# Altium project Proyecto0_V2.PrjPcb (part 3 of 3)

## Sheet USB_Port_FTT.SchDoc
size 431 x 279 mm; DrawnBy: Santiago Rodriguez; Revision: V1; SheetNumber: 3; SheetTotal: 9
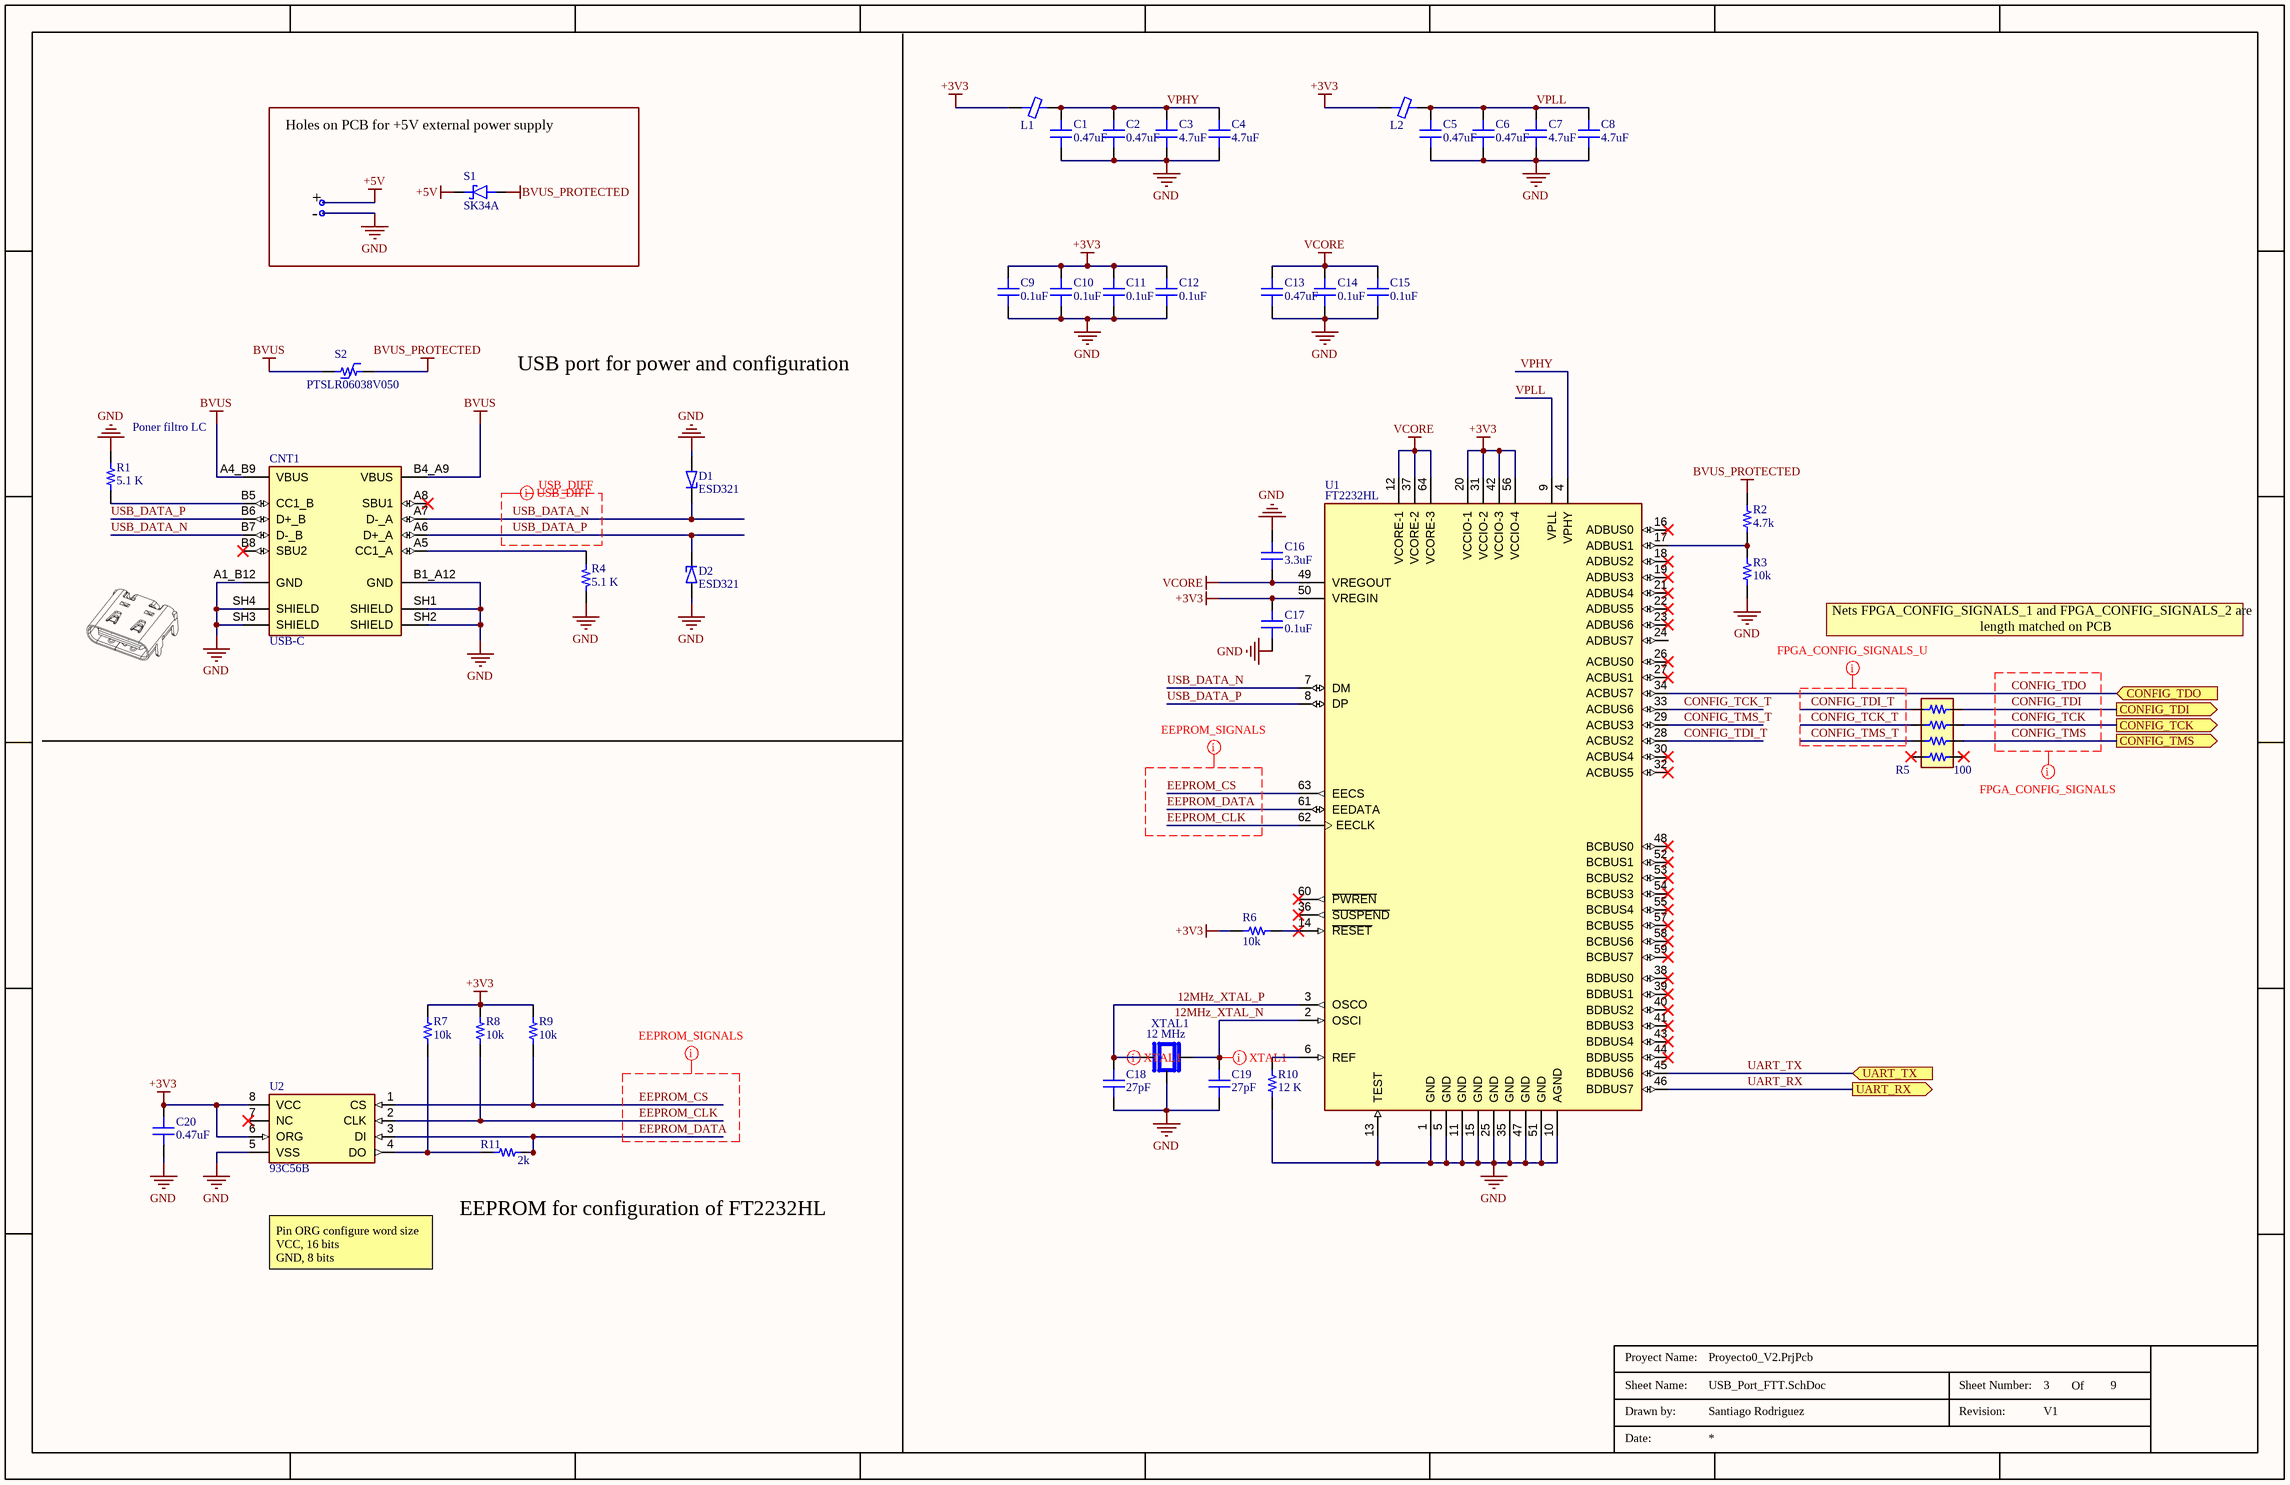
[diagram p11: USB_Port_FTT.SchDoc]

### Parts
C1  0.47uF  [CAP0402]
C2  0.47uF  [CAP0402]
C3  4.7uF  [CAP0402]
C4  4.7uF  [CAP0402]
C5  0.47uF  [CAP0402]
C6  0.47uF  [CAP0402]
C7  4.7uF  [CAP0402]
C8  4.7uF  [CAP0402]
C9  0.1uF  [CAP0402]
C10  0.1uF  [CAP0402]
C11  0.1uF  [CAP0402]
C12  0.1uF  [CAP0402]
C13  0.47uF  [CAP0402]
C14  0.1uF  [CAP0402]
C15  0.1uF  [CAP0402]
C16  3.3uF  [CAP0402]
C17  0.1uF  [CAP0402]
C18  27pF  [CAP0402]
C19  27pF  [CAP0402]
C20  0.47uF  [CAP0402]
CNT1  USB-C  [USB-C 2.0 24 PINS (16+8 DUMMY)]
D1  ESD321  [SOD-523]
D2  ESD321  [SOD-523]
L1  HZ0603C651R-10  [Fer0603]  (value not drawn)
L2  HZ0603C651R-10  [Fer0603]  (value not drawn)
R1  5.1 K  [RES0603]
R2  4.7k  [RES0402]
R3  10k  [RES0402]
R4  5.1 K  [RES0603]
R5  100  [ArrayResistor-1206]
R6  10k  [RES0402]
R7  10k  [RES0402]
R8  10k  [RES0402]
R9  10k  [RES0402]
R10  12 K  [RES0603]
R11  2k  [RES0402]
S1  SK34A  [Diode SMA-2]
S2  PTSLR06038V050  [PTSLR0603]
U1  FT2232HL  [LQPF-64]
U2  93C56B  [DFN-8]
XTAL1  12 MHz  [XTAL_ABM8G]

### Ports
CONFIG_TCK (out), CONFIG_TDI (out), CONFIG_TDO (in), CONFIG_TMS (out), UART_RX (out), UART_TX (in)

### Nets
+3V3: C9.2 C10.2 C11.2 C12.2 C17.2 C20.2 L1.1 L2.1 R6.1 R7.2 R8.2 R9.2 U1.20(VCCIO-1) U1.31(VCCIO-2) U1.42(VCCIO-3) U1.50(VREGIN) U1.56(VCCIO-4) U2.6(ORG) U2.8(VCC)
+5V: S1.C(K)
BVUS: CNT1.A4_B9(VBUS) CNT1.B4_A9(VBUS) S2.1
BVUS_PROTECTED: R2.2 S1.A S2.2
GND: C1.1 C2.1 C3.1 C4.1 C5.1 C6.1 C7.1 C8.1 C9.1 C10.1 C11.1 C12.1 C13.1 C14.1 C15.1 C16.2 C17.1 C18.1 C19.1 C20.1 CNT1.A1_B12(GND) CNT1.B1_A12(GND) CNT1.SH1(SHIELD) CNT1.SH2(SHIELD) CNT1.SH3(SHIELD) CNT1.SH4(SHIELD) D1.A D2.A R1.2 R3.1 R4.2 R10.1 U1.1(GND) U1.5(GND) U1.10(AGND) U1.11(GND) U1.13(TEST) U1.15(GND) U1.25(GND) U1.35(GND) U1.47(GND) U1.51(GND) U2.5(VSS) XTAL1.2
VCORE: C13.2 C14.2 C15.2 C16.1 U1.12(VCORE-1) U1.37(VCORE-2) U1.49(VREGOUT) U1.64(VCORE-3)
12MHz_XTAL_N: C19.2 U1.2(OSCI) XTAL1.3
12MHz_XTAL_P: C18.2 U1.3(OSCO) XTAL1.1
CONFIG_TCK: R5.7 ; port CONFIG_TCK
CONFIG_TCK_T: R5.3 U1.33(ACBUS6)
CONFIG_TDI: R5.8 ; port CONFIG_TDI
CONFIG_TDI_T: R5.1 U1.28(ACBUS2)
CONFIG_TDO: U1.34(ACBUS7) ; port CONFIG_TDO
CONFIG_TMS: R5.6 ; port CONFIG_TMS
CONFIG_TMS_T: R5.2 U1.29(ACBUS3)
EEPROM_CLK: R8.1 U1.62(EECLK) U2.2(CLK)
EEPROM_CS: R9.1 U1.63(EECS) U2.1(CS)
EEPROM_DATA: R11.2 U1.61(EEDATA) U2.3(DI)
UART_RX: U1.46(BDBUS7) ; port UART_RX
UART_TX: U1.45(BDBUS6) ; port UART_TX
USB_DATA_N: CNT1.A7(D-_A) CNT1.B7(D-_B) D1.K U1.7(DM)
USB_DATA_P: CNT1.A6(D+_A) CNT1.B6(D+_B) D2.K U1.8(DP)
VPHY: C1.2 C2.2 C3.2 C4.2 L1.2 U1.4(VPHY)
VPLL: C5.2 C6.2 C7.2 C8.2 L2.2 U1.9(VPLL)
NetCNT1_A5: CNT1.A5(CC1_A) R4.1
NetCNT1_B5: CNT1.B5(CC1_B) R1.1
NetR2_1: R2.1 R3.2 U1.17(ADBUS1)
NetR6_2: R6.2 U1.14(~{RESET})
NetR7_1: R7.1 R11.1 U2.4(DO)
NetR10_2: R10.2 U1.6(REF)

Not connected (* = marked no-connect by the designer): CNT1 A8(SBU1)* B8(SBU2)*; R5 4* 5*; U1 16(ADBUS0)* 18(ADBUS2)* 19(ADBUS3)* 21(ADBUS4)* 22(ADBUS5)* 23(ADBUS6)* 24(ADBUS7) 26(ACBUS0)* 27(ACBUS1)* 30(ACBUS4)* 32(ACBUS5)* 36(~{SUSPEND})* 38(BDBUS0)* 39(BDBUS1)* 40(BDBUS2)* 41(BDBUS3)* 43(BDBUS4)* 44(BDBUS5)* 48(BCBUS0)* 52(BCBUS1)* 53(BCBUS2)* 54(BCBUS3)* 55(BCBUS4)* 57(BCBUS5)* 58(BCBUS6)* 59(BCBUS7)* 60(~{PWREN})*; U2 7(NC)*

### Layout directives
differential pair: 12MHz_XTAL_N, 12MHz_XTAL_P
differential pair; differential pair class USB_DIFF: USB_DATA_N, USB_DATA_P
net class EEPROM_SIGNALS: EEPROM_CLK, EEPROM_CS, EEPROM_DATA
net class FPGA_CONFIG_SIGNALS: CONFIG_TCK, CONFIG_TDI, CONFIG_TDO, CONFIG_TMS
net class FPGA_CONFIG_SIGNALS_U: CONFIG_TCK_T, CONFIG_TDI_T, CONFIG_TMS_T

### Notes on the sheet
- Holes on PCB for +5V external power supply
- +
- -
- (near R1) Poner filtro LC
- USB port for power and configuration <MF-NSMF050>
- Nets FPGA_CONFIG_SIGNALS_1 and FPGA_CONFIG_SIGNALS_2 are
- length matched on PCB
- (near R11) EEPROM for configuration of FT2232HL <MF-NSMF050>
- Pin ORG configure word size
  VCC, 16 bits
  GND, 8 bits
- Proyect Name:
- Sheet Name:
- Drawn by:
- Revision:
- Sheet Number:
- Of
- Date:

### Library data of the parts
C1 C2 C5 C6 C13 C20 = C0402C474K8RAC: CAP CER 0.47uF 10V X7R 0402 10%; PartNumber: C0603C474K4RAC; Manufacturer: Kemet; ComponentLink1Description: DataSheet; ComponentLink1URL: https://content.kemet.com/datasheets/KEM_C1002_X7R_SMD.pdf; Size: 0402; ComponentLink2Description: DigiKey; ComponentLink2URL: https://www.digikey.com/en/products/filter/ceramic-capacitors/60?s=N4IgTCBcDaIMIAYAsCxyQdiQaQBwCUBBOEAXQF8g; ComponentLink3Description: ProductPage; ComponentLink3URL: https://www.kemet.com/en/us/product/C0805C474K4RACTU.html; Tolerance: 10%; Value: 0.47uF; Voltage: 10 V
C3 C4 C7 C8 = C0402C475M9PAC: CAP CER 4.7uF 6.3V X5R 0402 10%; Manufacturer: Kemet; Voltage: 16V; ComponentLink1Description: DataSheet; ComponentLink1URL: https://content.kemet.com/datasheets/KEM_C1002_X7R_SMD.pdf; Size: 0402; ComponentLink2Description: DigiKey; ComponentLink2URL: https://www.digikey.com/en/products/filter/ceramic-capacitors/60?s=N4IgTCBcDaIMIAYAsCxyQdgKwFsCcADgIYDGIAugL5A; PartNumber: C0402C475M9PAC; ComponentLink3Description: ProdructPage; ComponentLink3URL: https://www.kemet.com/en/us/search.html?q=C0402C475M9PAC; Value: 4.7uF; Tolerance: 10%
C9-C12 C14 C15 C17 = C0402C104K4RAC: CAP CER 0.1uF 16V X7R 0402 10%; Manufactuer: Kemet; ComponentLink1Description: DataSheet; ComponentLink1URL: https://content.kemet.com/datasheets/KEM_C1002_X7R_SMD.pdf; ComponentLink2Description: DigiKey; ComponentLink2URL: https://www.digikey.com/en/products/filter/ceramic-capacitors/60?s=N4IgTCBcDaIMIAYAsCxwIzINJIEoEE4QBdAXyA; Value: 0.1uF; Tolerance: 10%; Size: 0402; Voltage: 16V; PartNumber: C0402C104K4RAC
C16 = C0402C332K5RAC: CAP CER 3.3nF 50V X7R 0402 10%; Manufacturer: Kemet; ComponentLink1Description: DataSheet; ComponentLink1URL: https://content.kemet.com/datasheets/KEM_C1002_X7R_SMD.pdf; Size: 0402; ComponentLink2Description: DigiKey; ComponentLink2URL: https://www.digikey.com/en/products/filter/ceramic-capacitors/60?s=N4IgTCBcDaIMIAYAsCxwMzrAaQKwCUBBOEAXQF8g; Value: 3.3uF; PartNumber: C0402C332K5RAC; Tolerance: 10%; Voltage: 50V
C18 C19 = C0402C270K5RAC: CAP CER 27pF 50V X7R 0402 10%; Manufacturer: Kemet; ComponentLink1Description: DataSheet; ComponentLink1URL: https://content.kemet.com/datasheets/KEM_C1002_X7R_SMD.pdf; Size: 0402; ComponentLink2Description: DigiKey; ComponentLink2URL: https://www.digikey.com/en/products/detail/kemet/C0402C270K5RACTU/18167653?s=N4IgTCBcDaIMIAYAsCxzAdgQaQKwCUBBOEAXQF8g; Value: 27pF; Tolerance: 10%; PartNumber: C0402C270K5RAC; Voltage: 50V
CNT1 = USB-C: CONN USB2.0, TYP C, 24 PINS (16+8 DUMMY), SMD, RIGHT ANGLE; ComponentLink1Description: DigiKey; ComponentLink1URL: https://www.digikey.com/en/products/detail/amphenol-cs-commercial-products/12402012E212A/13683192; ComponentLink2Description: DataSheet; ComponentLink2URL: https://mm.digikey.com/Volume0/opasdata/d220001/medias/docus/2614/C12402012-4.pdf; Type: C 2.0; Pins: 24 (16+8 DUMMY)
D1 D2 = ESD321: 0.9pF 3.6V ±30kV ESD protection diode with 6.8V 16A TLP clamping for USB 2.0; Manufacturer: Texas Instruments; ComponentLink1Description: ProductPage; ComponentLink1URL: https://www.ti.com/product/ESD321; Package: SOD-523; ComponentLink2Description: DataSheet; ComponentLink2URL: https://www.ti.com/lit/ds/symlink/esd321.pdf?ts=1717079562669&ref_url=https%253A%252F%252Fwww.ti.com%252Fproduct%252FESD321%253FkeyMatch%253DESD321%2526tisearch%253Dsearch-everything%2526usecase%253DGPN-ALT; ComponentLink3Description: DigyKey; ComponentLink3URL: https://www.digikey.com/en/products/detail/texas-instruments/ESD321DYAR/17394968; PartNumber: ESD321
L1 L2 = HZ0603C651R-10: FERRITE BEAD 650 OHM 0603 1LN 0603; Z@100MHz: 650 Ohms; Current: 300 mA; DCR: 0.6 Ohm; ComponentLink1Description: DataSheet; ComponentLink1URL: https://www.laird.com/sites/default/files/hz0603c651r-10-datasheet.pdf; ComponentLink2Description: DigiKey; ComponentLink2URL: https://www.digikey.com/es/products/detail/laird-signal-integrity-products/HZ0603C651R-10/806620?s=N4IgTCBcDaIBIC0AMA2JBmAwigrARgCUBaPJEAXQF8g; PartNumber: HZ0603C651R-10; Size: 0603
R1 R4 = CRCW06035K10FKEA: RES SMD 5.1K OHM 1% 1/10W 0603; Value: 47 K; ComponentLink1Description: DataSheet; ComponentLink1URL: https://www.vishay.com/docs/20035/dcrcwe3.pdf; Size: 0603; ComponentLink2Description: DigiKey; ComponentLink2URL: https://www.digikey.com/es/products/detail/vishay-dale/crcw06035k10fkea/1174748
R2 = CRCW04024K70FK: RES SMD 4.7K OHM 1% 0.063W 0402; Manufacturer: Vishay; ComponentLink1Description: DataSheet; ComponentLink1URL: https://www.vishay.com/docs/20035/dcrcwe3.pdf; Size: 0402; ComponentLink2Description: DigiKey; ComponentLink2URL: https://www.digikey.com/es/products/filter/resistor-de-chip-montaje-en-superficie/52?s=N4IgTCBcDaIMICU4HUAMAWVZ0GkDsqAYjiALoC%20QA; Power: 0.063 W; PartNumber: CRCW04024K70FK; Value: 4.7k; Tolerance: 1%
R3 R6-R9 = CRCW040210K0FK: RES SMD 10K OHM 1% 0.063W 0402; Manufacturer: Vishay; ComponentLink1Description: DataSheet; ComponentLink1URL: https://www.vishay.com/docs/20035/dcrcwe3.pdf; Size: 0402; ComponentLink2Description: DigiKey; ComponentLink2URL: https://www.digikey.com/en/products/filter/chip-resistor-surface-mount/52?s=N4IgTCBcDaIMICU4HUAMAWVYCMqDSqAYniALoC%20QA; Value: 10k; Tolerance: 1%; PartNumber: CRCW040210K0FK; Power: 0.063W
R5 = EXB-38V101JV: RES ARRAY 4 RES 100 OHM 1206; Elements: 4; Value: 100 Ohms; ComponentLink1Description: DigiKey; ComponentLink1URL: https://www.digikey.com/en/products/detail/panasonic-electronic-components/EXB-38V101JV/256519?s=N4IgTCBcDaIKIA0BCBaAzADgGoEYAMOAUliALoC%2BQA; ComponentLink2Description: DataSheet; ComponentLink2URL: https://industrial.panasonic.com/cdbs/www-data/pdf/AOC0000/AOC0000C14.pdf; Size: 1206
R10 = CRCW060312K0FKEA: RES SMD 12K OHM 1% 1/10W 0603; ComponentLink1Description: DataSheet; ComponentLink1URL: https://www.vishay.com/docs/20035/dcrcwe3.pdf; Size: 0603; ComponentLink2Description: DigiKey; ComponentLink2URL: https://www.digikey.com/en/products/detail/vishay-dale/CRCW060312K0FKEA/1174790
R11 = CRCW04022K00FK: RES SMD 2K OHM 1% 0.063W 0402; Manufacturer: Vishay; ComponentLink1Description: DataSheet; ComponentLink1URL: https://www.vishay.com/docs/20035/dcrcwe3.pdf; ComponentLink2Description: DigiKey; ComponentLink2URL: https://www.digikey.com/en/products/filter/chip-resistor-surface-mount/52?s=N4IgTCBcDaIMYCc4HcAMAWVYwGtWoDMcQBdAXyA; PartNumber: CRCW04022K00FK; Power: 0.063W; Value: 2k; Tolerance: 1%; Size: 0402
S1 = SK34A: Diode schottky 40V 3A; Manufacturer: SMC Diode Solutions; Forward Voltage Drop: 0.63; ComponentLink1Description: DigiKey; ComponentLink1URL: https://www.digikey.com/en/products/detail/smc-diode-solutions/SK34A/6022681; Peak Reverse Voltage: 40V; Forward Current: 3A; ComponentLink2Description: DataSheet; ComponentLink2URL: https://www.smc-diodes.com/propdf/SK34A%20N0103%20REV.C.pdf; Package: SMA-2; PartNumber: SK34A
S2 = PTSLR06038V050: PTC resettable fuse 500mA, 8V, 0603; Manufacturer: Eaton; Itrip: 1A; MaxCurrent: 25A; ComponentLink1Description: DataSheet; ComponentLink1URL: https://www.eaton.com/content/dam/eaton/products/electronic-components/resources/data-sheet/eaton-ptslr0603-surface-mount-resettable-fuse-data-sheet-elx1047-en.pdf; PartNumber: PTSLR06038V050; Size: 0603; Ihold: 500mA; ComponentLink2Description: DigiKey; ComponentLink2URL: https://www.digikey.com/es/products/detail/eaton-electronics-division/PTSLR06038V050/15193495?s=N4IgTCBcDaIAoBUDKAZASgBgGwYMwA4A1DAVgxAF0BfIA; MaxVoltage: 8V
U1 = FT2232HL: Dual High Speed USB to Multipurpose UART/FIFO IC; Manufacturer: FTDI Chip; ComponentLink1Description: DataSheet; ComponentLink1URL: https://ftdichip.com/wp-content/uploads/2020/07/DS_FT2232H.pdf; ComponentLink2Description: DigiKey; ComponentLink2URL: https://www.digikey.com/en/products/detail/ftdi-future-technology-devices-international-ltd/FT2232HL-REEL/1986053; Package: LQFP-64; PartNumber: FT2232HL
U2 = EEPROM: 2K Microwire Compatible Serial EEPROM; ComponentLink1Description: DataSheet; ComponentLink1URL: https://www.snapeda.com/parts/93C56BT-I/MC/Microchip/datasheet/
XTAL1 = XTAL_12MHz: Crystal 12 MHz; Manufacturer: Abracom; ComponentLink1Description: DataDheet; ComponentLink1URL: https://www.snapeda.com/parts/ABM8G-16.000MHZ-B4Y-T/Abracon/datasheet/; Frequency: 12 MHz; Series: ABM8G

## Nets that join several sheets
+1V: FPGA_Power&Ports (17 pins), Power_Supply (5 pins)
+1V8: Bank_A-B-C-D (CNT4.33 CNT4.36 CNT4.37), FPGA_Power&Ports (10 pins), Power_Supply (7 pins)
+1V8': FPGA_Power&Ports (C36.2 L3.1), Power_Supply (C98.2 R44.2 U7.7)
+1V25_VREF_ADC: Bank_A-B-C-D (CNT4.40), FPGA_Power&Ports (C52.2 C53.2 U4.J8 U5.2)
+1V35: DDR_Memory (28 pins), FPGA_Power&Ports (13 pins), Power_Supply (C97.2 L8.2 R25.2 R41.2)
+3V3: Bank_A-B-C-D (32 pins), Flash_Memory (5 pins), FPGA_Power&Ports (34 pins), Leds_and_Buttons (R48.2), Power_Supply (7 pins), USB_Port_FTT (19 pins)
+3V3/+1V8: FPGA_Power&Ports (8 pins), Power_Supply (U9.B1)
+5V: Bank_A-B-C-D (8 pins), Power_Supply (11 pins), USB_Port_FTT (S1.C)
AGND: Bank_A-B-C-D (CNT4.39), FPGA_Power&Ports (8 pins)
GND: Bank_A-B-C-D (32 pins), DDR_Memory (34 pins), Flash_Memory (C21.1 U3.4 U3.9), FPGA_Power&Ports (80 pins), Leds_and_Buttons (10 pins), Power_Supply (41 pins), USB_Port_FTT (44 pins)
100MHz: Bank_A-B-C-D (CNT4.43), FPGA_Power&Ports (U4.N11 XTAL2.3)
A2: Bank_A-B-C-D (CNT5.39), FPGA_Power&Ports (U4.A3)
A3: Bank_A-B-C-D (CNT5.45), FPGA_Power&Ports (U4.B7)
A4: Bank_A-B-C-D (CNT5.6), FPGA_Power&Ports (U4.C6)
A5: Bank_A-B-C-D (CNT5.5), FPGA_Power&Ports (U4.C7)
A7: Bank_A-B-C-D (CNT5.3), FPGA_Power&Ports (U4.D6)
ADD0: DDR_Memory (U6.N3), FPGA_Power&Ports (U4.D8)
ADD1: DDR_Memory (U6.P7), FPGA_Power&Ports (U4.E13)
ADD2: DDR_Memory (U6.P3), FPGA_Power&Ports (U4.E12)
ADD3: DDR_Memory (U6.N2), FPGA_Power&Ports (U4.F14)
ADD4: DDR_Memory (U6.P8), FPGA_Power&Ports (U4.F12)
ADD5: DDR_Memory (U6.P2), FPGA_Power&Ports (U4.G14)
ADD6: DDR_Memory (U6.R8), FPGA_Power&Ports (U4.H12)
ADD7: DDR_Memory (U6.R2), FPGA_Power&Ports (U4.E11)
ADD8: DDR_Memory (U6.T8), FPGA_Power&Ports (U4.D13)
ADD9: DDR_Memory (U6.R3), FPGA_Power&Ports (U4.H14)
ADD10: DDR_Memory (U6.L7), FPGA_Power&Ports (U4.B11)
ADD11: DDR_Memory (U6.R7), FPGA_Power&Ports (U4.F13)
ADD12: DDR_Memory (U6.N7), FPGA_Power&Ports (U4.D11)
ADD13: DDR_Memory (U6.T3), FPGA_Power&Ports (U4.G11)
ADD14: DDR_Memory (U6.T7), FPGA_Power&Ports (U4.H13)
B1: Bank_A-B-C-D (CNT5.15), FPGA_Power&Ports (U4.D3)
B2: Bank_A-B-C-D (CNT5.40), FPGA_Power&Ports (U4.A4)
B4: Bank_A-B-C-D (CNT5.46), FPGA_Power&Ports (U4.D5)
B5: Bank_A-B-C-D (CNT5.48), FPGA_Power&Ports (U4.F4)
B6: Bank_A-B-C-D (CNT5.49), FPGA_Power&Ports (U4.F5)
B7: Bank_A-B-C-D (CNT5.2), FPGA_Power&Ports (U4.D4)
BA0: DDR_Memory (U6.M2), FPGA_Power&Ports (U4.C8)
BA1: DDR_Memory (U6.N8), FPGA_Power&Ports (U4.C12)
BA2: DDR_Memory (U6.M3), FPGA_Power&Ports (U4.D9)
C1: Bank_A-B-C-D (CNT5.14), FPGA_Power&Ports (U4.B4)
C2: Bank_A-B-C-D (CNT5.12), FPGA_Power&Ports (U4.C4)
C3: Bank_A-B-C-D (CNT5.11), FPGA_Power&Ports (U4.B5)
C4: Bank_A-B-C-D (CNT5.33), FPGA_Power&Ports (U4.E1)
C6: Bank_A-B-C-D (CNT5.9), FPGA_Power&Ports (U4.E5)
C7: Bank_A-B-C-D (CNT5.8), FPGA_Power&Ports (U4.B6)
~{CAS}: DDR_Memory (U6.K3), FPGA_Power&Ports (U4.C11)
~{CS}: DDR_Memory (U6.L2), FPGA_Power&Ports (U4.J16)
CK_N: DDR_Memory (U6.K7), FPGA_Power&Ports (U4.H16)
CK_P: DDR_Memory (U6.J7), FPGA_Power&Ports (U4.G16)
CKE: DDR_Memory (U6.K9), FPGA_Power&Ports (U4.G12)
CONFIG_TCK: Bank_A-B-C-D (CNT4.30), FPGA_Power&Ports (U4.L7), USB_Port_FTT (R5.7)
CONFIG_TDI: Bank_A-B-C-D (CNT4.28), FPGA_Power&Ports (U4.N7), USB_Port_FTT (R5.8)
CONFIG_TDO: Bank_A-B-C-D (CNT4.34), FPGA_Power&Ports (U4.N8), USB_Port_FTT (U1.34)
CONFIG_TMS: Bank_A-B-C-D (CNT4.31), FPGA_Power&Ports (U4.M7), USB_Port_FTT (R5.6)
D1: Bank_A-B-C-D (CNT5.36), FPGA_Power&Ports (U4.B1)
D3: Bank_A-B-C-D (CNT5.18), FPGA_Power&Ports (U4.A2)
D4: Bank_A-B-C-D (CNT5.34), FPGA_Power&Ports (U4.E2)
D5: Bank_A-B-C-D (CNT5.42), FPGA_Power&Ports (U4.A5)
D6: Bank_A-B-C-D (CNT5.43), FPGA_Power&Ports (U4.A7)
~{DDR_RESET}: DDR_Memory (U6.T2), FPGA_Power&Ports (U4.J15)
DONE: Bank_A-B-C-D (CNT4.12), FPGA_Power&Ports (R16.1 R17.1 U4.H10)
DQ0: DDR_Memory (U6.E3), FPGA_Power&Ports (U4.C14)
DQ1: DDR_Memory (U6.F7), FPGA_Power&Ports (U4.B12)
DQ2: DDR_Memory (U6.F2), FPGA_Power&Ports (U4.D15)
DQ3: DDR_Memory (U6.F8), FPGA_Power&Ports (U4.A15)
DQ4: DDR_Memory (U6.H3), FPGA_Power&Ports (U4.E15)
DQ5: DDR_Memory (U6.H8), FPGA_Power&Ports (U4.C13)
DQ6: DDR_Memory (U6.G2), FPGA_Power&Ports (U4.D14)
DQ7: DDR_Memory (U6.H7), FPGA_Power&Ports (U4.F15)
DQ8: DDR_Memory (U6.D7), FPGA_Power&Ports (U4.A10)
DQ9: DDR_Memory (U6.C3), FPGA_Power&Ports (U4.A14)
DQ10: DDR_Memory (U6.C8), FPGA_Power&Ports (U4.B9)
DQ11: DDR_Memory (U6.C2), FPGA_Power&Ports (U4.A13)
DQ12: DDR_Memory (U6.A7), FPGA_Power&Ports (U4.A8)
DQ13: DDR_Memory (U6.A2), FPGA_Power&Ports (U4.A12)
DQ14: DDR_Memory (U6.B8), FPGA_Power&Ports (U4.A9)
DQ15: DDR_Memory (U6.A3), FPGA_Power&Ports (U4.B10)
E1: Bank_A-B-C-D (CNT5.24), FPGA_Power&Ports (U4.D1)
E2: Bank_A-B-C-D (CNT5.37), FPGA_Power&Ports (U4.B2)
E3: Bank_A-B-C-D (CNT5.17), FPGA_Power&Ports (U4.C3)
E5: Bank_A-B-C-D (CNT5.21), FPGA_Power&Ports (U4.C2)
E6: Bank_A-B-C-D (CNT4.14), FPGA_Power&Ports (U4.H5)
F2: Bank_A-B-C-D (CNT5.23), FPGA_Power&Ports (U4.C1)
F3: Bank_A-B-C-D (CNT5.30), FPGA_Power&Ports (U4.F2)
F4: Bank_A-B-C-D (CNT5.31), FPGA_Power&Ports (U4.F3)
F5: Bank_A-B-C-D (CNT5.20), FPGA_Power&Ports (U4.E3)
G1: Bank_A-B-C-D (CNT3.15), FPGA_Power&Ports (U4.H3)
G2: Bank_A-B-C-D (CNT3.14), FPGA_Power&Ports (U4.H2)
G4: Bank_A-B-C-D (CNT5.27), FPGA_Power&Ports (U4.G1)
G5: Bank_A-B-C-D (CNT5.28), FPGA_Power&Ports (U4.H4)
H1: Bank_A-B-C-D (CNT3.21), FPGA_Power&Ports (U4.J4)
H2: Bank_A-B-C-D (CNT3.20), FPGA_Power&Ports (U4.J3)
H3: Bank_A-B-C-D (CNT3.30), FPGA_Power&Ports (U4.L2)
H4: Bank_A-B-C-D (CNT3.18), FPGA_Power&Ports (U4.L3)
H5: Bank_A-B-C-D (CNT3.17), FPGA_Power&Ports (U4.K3)
IN_Filter_ADC_N: Bank_A-B-C-D (CNT4.21), FPGA_Power&Ports (R21.2)
IN_Filter_ADC_P: Bank_A-B-C-D (CNT4.20), FPGA_Power&Ports (R20.2)
J1: Bank_A-B-C-D (CNT3.24), FPGA_Power&Ports (U4.J5)
J3: Bank_A-B-C-D (CNT3.31), FPGA_Power&Ports (U4.K2)
J4: Bank_A-B-C-D (CNT3.33), FPGA_Power&Ports (U4.J1)
J5: Bank_A-B-C-D (CNT3.34), FPGA_Power&Ports (U4.H1)
K1: Bank_A-B-C-D (CNT3.23), FPGA_Power&Ports (U4.K5)
K2: Bank_A-B-C-D (CNT4.18), FPGA_Power&Ports (U4.G4)
K3: Bank_A-B-C-D (CNT4.17), FPGA_Power&Ports (U4.G5)
K5: Bank_A-B-C-D (CNT4.15), FPGA_Power&Ports (U4.E6)
K13: Bank_A-B-C-D (CNT2.28), FPGA_Power&Ports (U4.N6)
L1_N: Bank_A-B-C-D (CNT3.3), FPGA_Power&Ports (U4.P1)
L1_P: Bank_A-B-C-D (CNT3.2), FPGA_Power&Ports (U4.N1)
L2: Bank_A-B-C-D (CNT3.27), FPGA_Power&Ports (U4.G2)
L2_N: Bank_A-B-C-D (CNT3.48), FPGA_Power&Ports (U4.M4)
L2_P: Bank_A-B-C-D (CNT3.49), FPGA_Power&Ports (U4.L4)
L3: Bank_A-B-C-D (CNT3.28), FPGA_Power&Ports (U4.K1)
L3_N: Bank_A-B-C-D (CNT3.5), FPGA_Power&Ports (U4.R1)
L3_P: Bank_A-B-C-D (CNT3.6), FPGA_Power&Ports (U4.R2)
L4_N: Bank_A-B-C-D (CNT3.46), FPGA_Power&Ports (U4.M1)
L4_P: Bank_A-B-C-D (CNT3.45), FPGA_Power&Ports (U4.M2)
L5: Bank_A-B-C-D (CNT4.9), FPGA_Power&Ports (U4.L5)
L5_N: Bank_A-B-C-D (CNT3.8), FPGA_Power&Ports (U4.T2)
L5_P: Bank_A-B-C-D (CNT3.9), FPGA_Power&Ports (U4.R3)
L6_N: Bank_A-B-C-D (CNT3.43), FPGA_Power&Ports (U4.N2)
L6_P: Bank_A-B-C-D (CNT3.42), FPGA_Power&Ports (U4.N3)
L7_N: Bank_A-B-C-D (CNT3.11), FPGA_Power&Ports (U4.T3)
L7_P: Bank_A-B-C-D (CNT3.12), FPGA_Power&Ports (U4.T4)
L8_N: Bank_A-B-C-D (CNT3.40), FPGA_Power&Ports (U4.P3)
L8_P: Bank_A-B-C-D (CNT3.39), FPGA_Power&Ports (U4.P4)
L9_N: Bank_A-B-C-D (CNT3.37), FPGA_Power&Ports (U4.N4)
L9_P: Bank_A-B-C-D (CNT3.36), FPGA_Power&Ports (U4.M5)
L13: Bank_A-B-C-D (CNT2.17), FPGA_Power&Ports (U4.M14)
LDM: DDR_Memory (U6.E7), FPGA_Power&Ports (U4.B14)
LDQS_N: DDR_Memory (U6.G3), FPGA_Power&Ports (U4.E16)
LDQS_P: DDR_Memory (U6.F3), FPGA_Power&Ports (U4.D16)
LED0: Bank_A-B-C-D (CNT4.49), FPGA_Power&Ports (U4.T15), Leds_and_Buttons (R47.1)
LED1: Bank_A-B-C-D (CNT4.48), FPGA_Power&Ports (U4.R15), Leds_and_Buttons (R47.2)
LED2: Bank_A-B-C-D (CNT4.46), FPGA_Power&Ports (U4.R16), Leds_and_Buttons (R47.3)
LED3: Bank_A-B-C-D (CNT4.45), FPGA_Power&Ports (U4.P15), Leds_and_Buttons (R47.4)
LED4: Bank_A-B-C-D (CNT4.2), FPGA_Power&Ports (U4.P16), Leds_and_Buttons (R47.5)
LED5: Bank_A-B-C-D (CNT4.3), FPGA_Power&Ports (U4.N16), Leds_and_Buttons (R47.6)
LED6: Bank_A-B-C-D (CNT4.5), FPGA_Power&Ports (U4.M15), Leds_and_Buttons (R47.7)
LED7: Bank_A-B-C-D (CNT4.6), FPGA_Power&Ports (U4.M16), Leds_and_Buttons (R47.8)
M6: Bank_A-B-C-D (CNT2.23), FPGA_Power&Ports (U4.L14)
M15: Bank_A-B-C-D (CNT2.49), FPGA_Power&Ports (U4.P8)
N6: Bank_A-B-C-D (CNT2.18), FPGA_Power&Ports (U4.M12)
N9: Bank_A-B-C-D (CNT2.37), FPGA_Power&Ports (U4.T9)
N11: Bank_A-B-C-D (CNT2.8), FPGA_Power&Ports (U4.P11)
N12: Bank_A-B-C-D (CNT2.9), FPGA_Power&Ports (U4.N12)
N13: Bank_A-B-C-D (CNT2.46), FPGA_Power&Ports (U4.P9)
NetCNT4_27: Bank_A-B-C-D (CNT4.27), Power_Supply (U9.B3)
ODT: DDR_Memory (U6.K1), FPGA_Power&Ports (U4.G15)
P5: Bank_A-B-C-D (CNT4.8), FPGA_Power&Ports (U4.P5)
P8: Bank_A-B-C-D (CNT2.34), FPGA_Power&Ports (U4.T8)
P9: Bank_A-B-C-D (CNT2.36), FPGA_Power&Ports (U4.R8)
P10: Bank_A-B-C-D (CNT2.43), FPGA_Power&Ports (U4.R10)
P11: Bank_A-B-C-D (CNT2.42), FPGA_Power&Ports (U4.T12)
P13: Bank_A-B-C-D (CNT2.45), FPGA_Power&Ports (U4.N9)
P14: Bank_A-B-C-D (CNT2.48), FPGA_Power&Ports (U4.T10)
PROGRAM_B: Bank_A-B-C-D (CNT4.11), FPGA_Power&Ports (R19.1 U4.L9)
QSPI_~{CS}: Flash_Memory (R14.1 U3.1), FPGA_Power&Ports (U4.L12)
QSPI_CLK: Flash_Memory (U3.6), FPGA_Power&Ports (U4.E8)
QSPI_DATA0: Flash_Memory (R15.4), FPGA_Power&Ports (U4.K16)
QSPI_DATA1: Flash_Memory (R15.2), FPGA_Power&Ports (U4.J14)
QSPI_DATA2: Flash_Memory (R15.3), FPGA_Power&Ports (U4.K15)
QSPI_DATA3: Flash_Memory (R15.1), FPGA_Power&Ports (U4.J13)
R7: Bank_A-B-C-D (CNT2.27), FPGA_Power&Ports (U4.T5)
R8: Bank_A-B-C-D (CNT2.33), FPGA_Power&Ports (U4.T7)
R10: Bank_A-B-C-D (CNT2.14), FPGA_Power&Ports (U4.N13)
R11: Bank_A-B-C-D (CNT2.15), FPGA_Power&Ports (U4.N14)
R12: Bank_A-B-C-D (CNT2.11), FPGA_Power&Ports (U4.P14)
R13: Bank_A-B-C-D (CNT2.40), FPGA_Power&Ports (U4.R11)
R15: Bank_A-B-C-D (CNT2.2), FPGA_Power&Ports (U4.T13)
R16: Bank_A-B-C-D (CNT2.3), FPGA_Power&Ports (U4.R12)
~{RAS}: DDR_Memory (U6.J3), FPGA_Power&Ports (U4.C9)
RESET: Bank_A-B-C-D (CNT4.42), FPGA_Power&Ports (U4.R5), Leds_and_Buttons (R48.1 S3.1 S3.2)
T5: Bank_A-B-C-D (CNT2.24), FPGA_Power&Ports (U4.K13)
T7: Bank_A-B-C-D (CNT2.20), FPGA_Power&Ports (U4.K12)
T8: Bank_A-B-C-D (CNT2.21), FPGA_Power&Ports (U4.L13)
T9: Bank_A-B-C-D (CNT2.31), FPGA_Power&Ports (U4.R7)
T10: Bank_A-B-C-D (CNT2.30), FPGA_Power&Ports (U4.M6)
T12: Bank_A-B-C-D (CNT2.12), FPGA_Power&Ports (U4.P13)
T13: Bank_A-B-C-D (CNT2.39), FPGA_Power&Ports (U4.P10)
T14: Bank_A-B-C-D (CNT2.5), FPGA_Power&Ports (U4.T14)
T15: Bank_A-B-C-D (CNT2.6), FPGA_Power&Ports (U4.R13)
UART_RX: Bank_A-B-C-D (CNT4.23), FPGA_Power&Ports (U4.P6), USB_Port_FTT (U1.46)
UART_TX: Bank_A-B-C-D (CNT4.24), FPGA_Power&Ports (U4.R6), USB_Port_FTT (U1.45)
UDM: DDR_Memory (U6.D3), FPGA_Power&Ports (U4.B15)
UDQS_N: DDR_Memory (U6.B7), FPGA_Power&Ports (U4.B16)
UDQS_P: DDR_Memory (U6.C7), FPGA_Power&Ports (U4.C16)
~{WE}: DDR_Memory (U6.L3), FPGA_Power&Ports (U4.D10)